# EAGLE design hexg-001 (EAGLE 9.6.2)
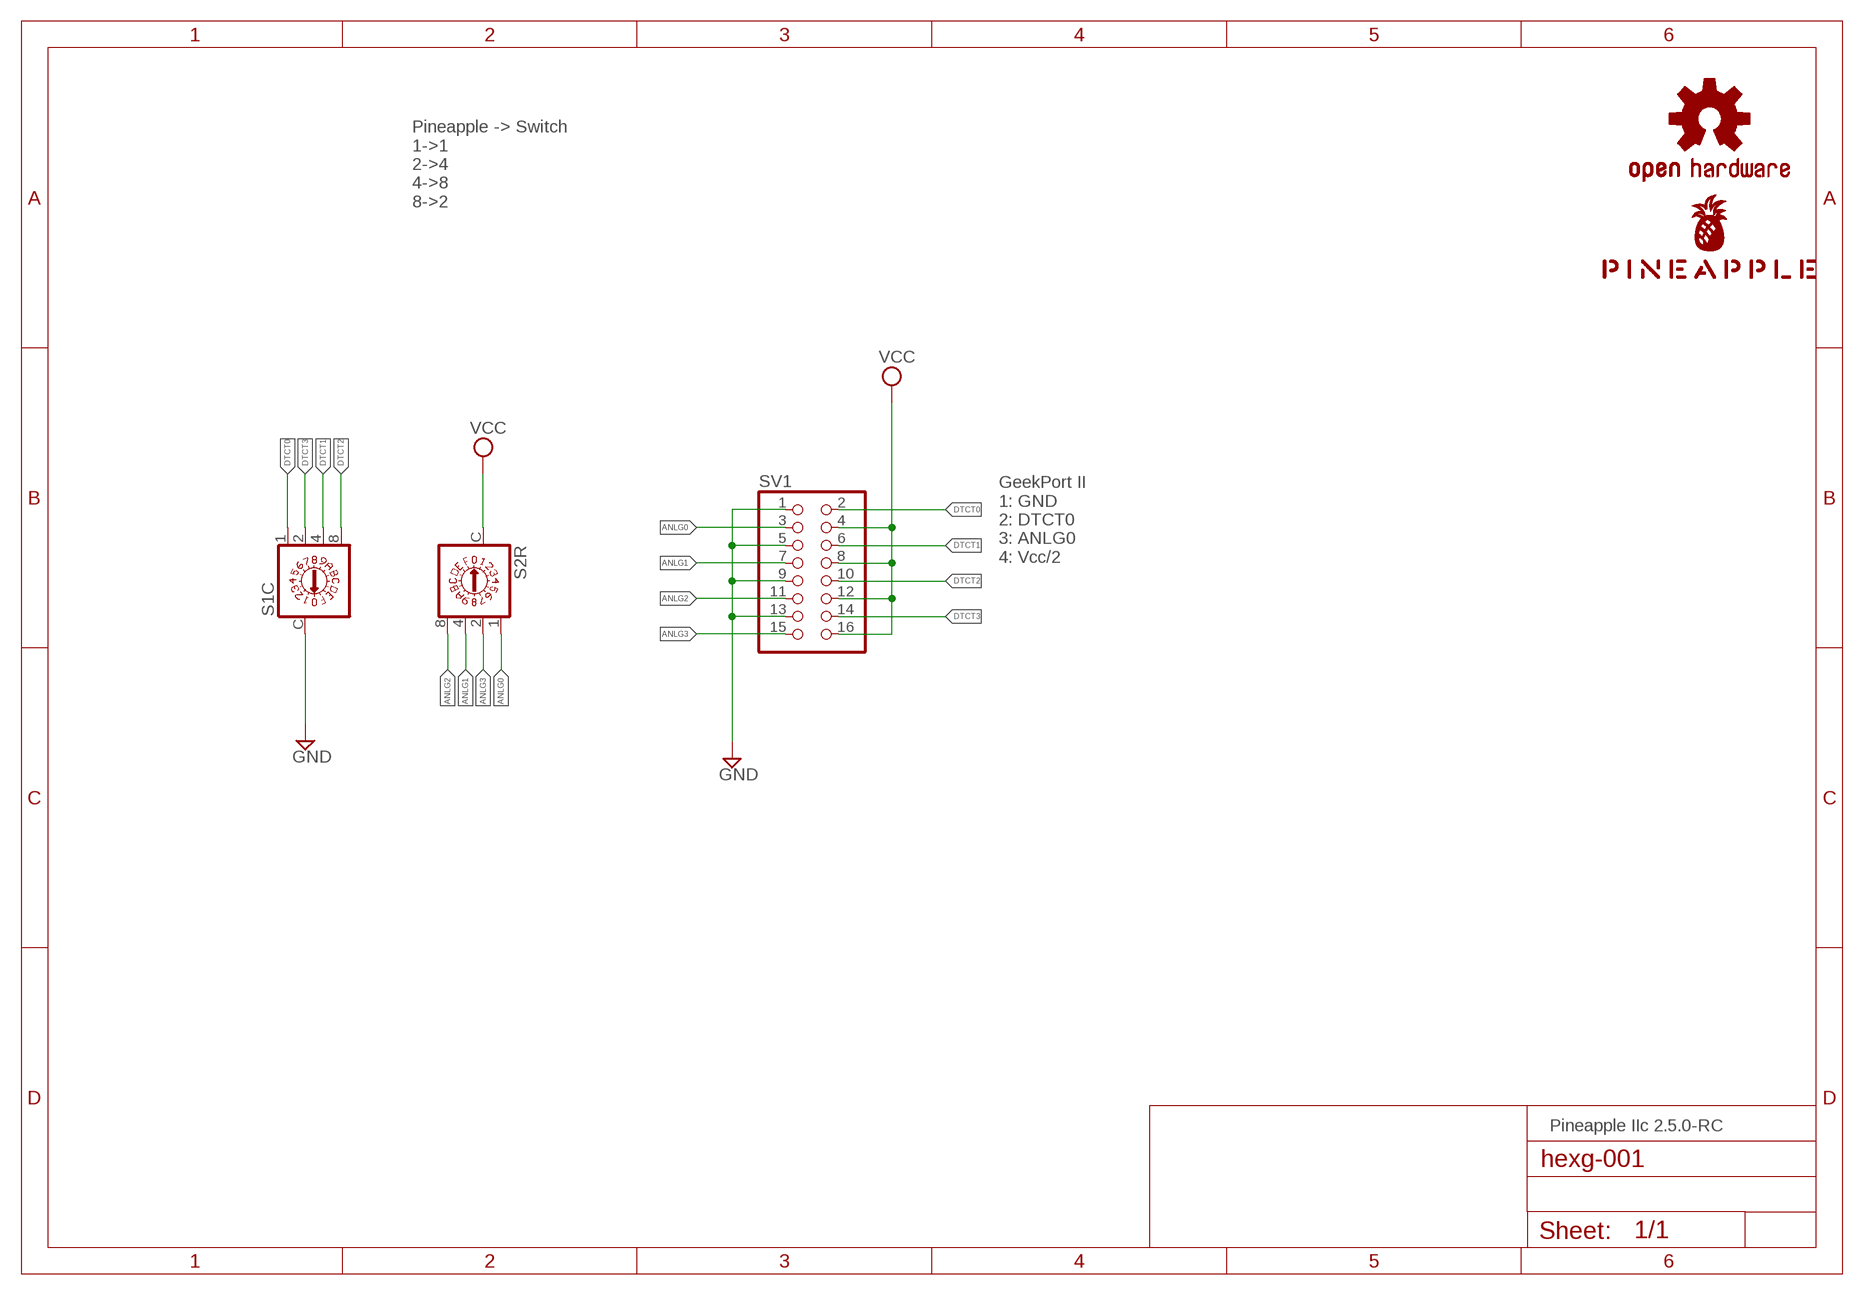
[diagram p0: schematic, sheet 1]

## Parts
LOGO1  OSHW-LOGOS-COPPER  [OSHW-LOGO-S_COPPER]
S1C  A1353HEX  [A1353HEX]
S2R  A1353HEX  [A1353HEX]
SV1  PINHD-2X8  [2X08]
U$1  PINEAPPLE450_SILK  [PINEAPPLE450_SILK]

## Nets
ANLG0: S2R.1 SV1.3
ANLG1: S2R.4 SV1.7
ANLG2: S2R.8 SV1.11
ANLG3: S2R.2 SV1.15
DTCT0: S1C.1 SV1.2
DTCT1: S1C.4 SV1.6
DTCT2: S1C.8 SV1.10
DTCT3: S1C.2 SV1.14
GND: S1C.C SV1.1 SV1.5 SV1.9 SV1.13
VCC: S2R.C SV1.4 SV1.8 SV1.12 SV1.16

## Notes on the sheet
- Pineapple -> Switch
  1->1
  2->4
  4->8
  8->2
- GeekPort II
  1: GND
  2: DTCT0
  3: ANLG0
  4: Vcc/2
- Pineapple IIc 2.5.0-RC

## Library data of the parts
LOGO1 = SparkFun-Aesthetics:OSHW-LOGO: Open-Source Hardware (OSHW) Logo This logo indicates the piece of hardware it is found on incorporates a OSHW license and/or adheres to the definition of open source hardware found here: http://freedomdefined.org/OSHW
S1C S2R = switch-dil:A1353HEX: DIL/CODE SWITCH; OC_FARNELL: unknown; OC_NEWARK: unknown
SV1 = pinhead:PINHD-2X8: PIN HEADER
U$1 = pineapple:PINEAPPLE450_SILK

## Net classes
0 default: width 0.152 mm, drill 0.152 mm, clearance 0.152 mm
1 ground: width 0.305 mm, drill 0.152 mm, clearance 0.152 mm
2 power1: width 0.508 mm, drill 0.152 mm, clearance 0.152 mm
3 power2: width 0.61 mm, drill 0.152 mm, clearance 0.152 mm
4 analog: width 0.305 mm, drill 0.152 mm, clearance 0.152 mm
5 external: width 0.152 mm, drill 0.152 mm, clearance 0.152 mm

## Board
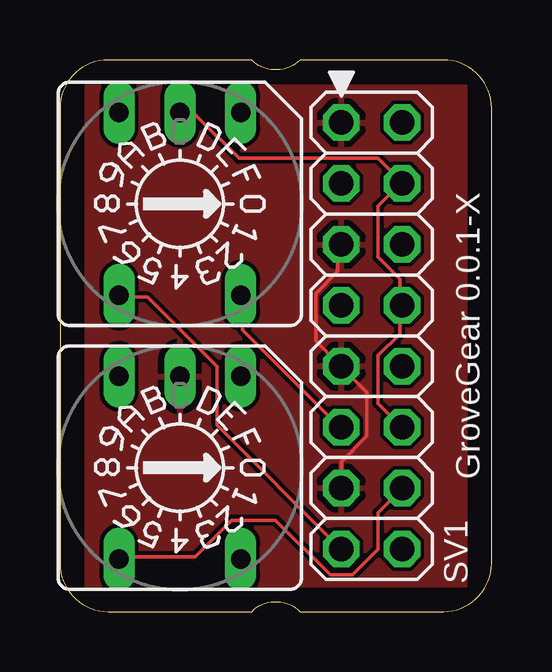
[diagram p1: board, top side]
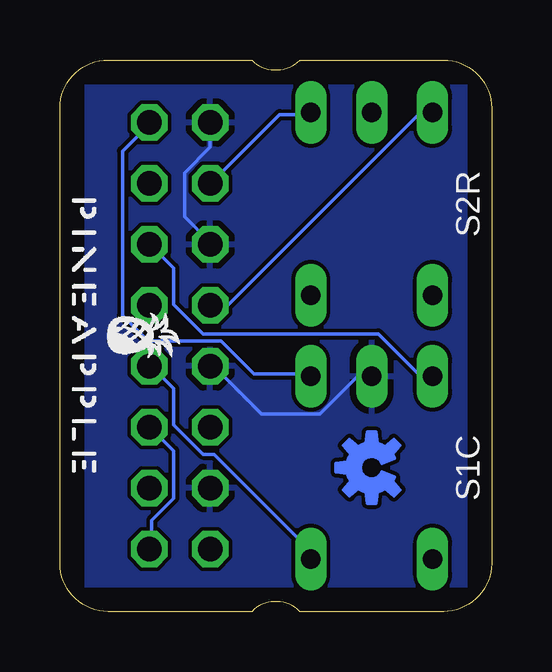
[diagram p2: board, bottom side, seen from below]

Size 18 x 23 mm. Coordinates in mm from the lower left corner, seen from the top.
Outline: 0,21 0,2 arc90 2,0 8,0 arc-90 10,0 16,0 arc90 18,2 18,21 arc90 16,23 10,23 arc-90 8,23 2,23 arc90 0,21
Copper layers (1*16): Top 0.035mm / dielectric 1.5mm / Bottom 0.035mm
Design rules "SeeedStudio_2layer_DRU_no_angle_20140221": minimum track width 6mil, minimum drill 12mil, track to track 6mil, track to pad 6mil, pad to pad 6mil, via to via 6mil, smd to smd 0mil, copper to edge 10mil, drill to drill 10mil, minimum pad ring 10mil, minimum via ring 6mil, stop-mask expansion 2mil, vias tented up to drill 100mil, thermal gap 10mil
tRestrict: area 0,0 to 1,23; area 0,22 to 18,23; area 17,0 to 18,23; area 0,0 to 18,1
bRestrict: area 0,0 to 18,1; area 17,0 to 18,23; area 0,22 to 18,23; area 0,0 to 1,23

### Footprints (pad centres in the part's own frame; a part is rotated, then mirrored left to right if it is on the bottom)
A1353HEX = drill 0.813 long: 1 3.81,-2.54; 2 -3.81,2.54; 4 3.81,2.54; 8 -3.81,-2.54; C 3.81,0
2X08 = drill 1.016 octagon: 1 -8.89,-1.27; 2 -8.89,1.27; 3 -6.35,-1.27; 4 -6.35,1.27; 5 -3.81,-1.27; 6 -3.81,1.27; 7 -1.27,-1.27; 8 -1.27,1.27; 9 1.27,-1.27; 10 1.27,1.27; 11 3.81,-1.27; 12 3.81,1.27; 13 6.35,-1.27; 14 6.35,1.27; 15 8.89,-1.27; 16 8.89,1.27

### Placement (x,y rotation side)
LOGO1  5,6 90 bottom
S1C  5,6 90 top
S2R  5,17 90 top
SV1  13,11.5 270 top
U$1  17.5,11.5 270 bottom

### Tracks (layer width: path | path; a pad name or v marks a point on that pad's centre or on a via)
ANLG0
  Bottom 0.152: S2R.1 7.62,20.73 8.84,20.73 11.58,17.98 SV1.3
ANLG1
  Bottom 0.152: S2R.4 2.59,20.73 3.05,20.73 10.97,12.8 11.58,12.8 SV1.7
ANLG2
  Top 0.152: S2R.8 7.62,13.11 7.62,11.73 11.58,7.77 SV1.11
ANLG3
  Top 0.152: S2R.2 2.59,13.11 3.66,13.11 6.55,10.21 6.55,7.77 11.58,2.74 SV1.15
DTCT0
  Bottom 0.152: S1C.1 7.62,9.91 9.91,9.91 11.28,11.28 14.33,11.28 15.39,12.34 15.39,19.2 14.33,20.27 SV1.2
DTCT1
  Bottom 0.152: S1C.4 2.59,9.91 3.05,9.91 4.72,11.58 12.04,11.58 13.26,12.8 13.26,14.33 14.17,15.24 SV1.6
DTCT2
  Bottom 0.152: S1C.8 7.62,2.29 7.62,2.59 11.58,6.55 12.04,6.55 13.26,7.77 13.26,9.3 14.17,10.21 SV1.10
DTCT3
  Top 0.152: S1C.2 2.59,2.29 5.64,2.29 7.16,3.81 8.99,3.81 11.28,1.52 12.19,1.52 13.26,2.59 13.26,4.12 14.17,5.03 SV1.14
GND
  Top 0.152: SV1.13 11.73,5.18 11.73,6.25 12.8,7.32 12.8,9.14 11.73,10.21 SV1.9 11.58,10.36 10.67,11.28 10.67,13.26 11.58,14.17 11.58,15.24 SV1.5
  Bottom 0.152: S1C.C 5.03,9.75 5.64,9.75 7.16,8.23 9.6,8.23 11.58,10.21 SV1.9 | SV1.1 11.73,20.27 11.73,19.36 12.8,18.29 12.8,16.46 11.73,15.39 SV1.5
  pour Top: -1,-1 19,-1 19,24 -1,24
  pour Bottom: -2,-2 20,-2 20,25 -2,25
VCC
  Top 0.152: SV1.12 14.17,7.77 13.26,8.69 13.26,10.67 14.17,11.58 14.17,12.65 SV1.8 14.17,12.8 14.17,13.87 13.26,14.78 13.26,16.92 14.17,17.83 SV1.4 14.17,17.98 13.26,18.9 7.47,18.9 5.64,20.73 5.03,20.73 S2R.C
  Bottom 0.152: SV1.16 14.17,2.74 14.17,3.81 13.26,4.72 13.26,6.71 14.17,7.62 SV1.12

### Text on the board
tNames: GroveGear 0.0.1-X